# EAGLE design RAWX_Logger_Switches (EAGLE 9.4.1)
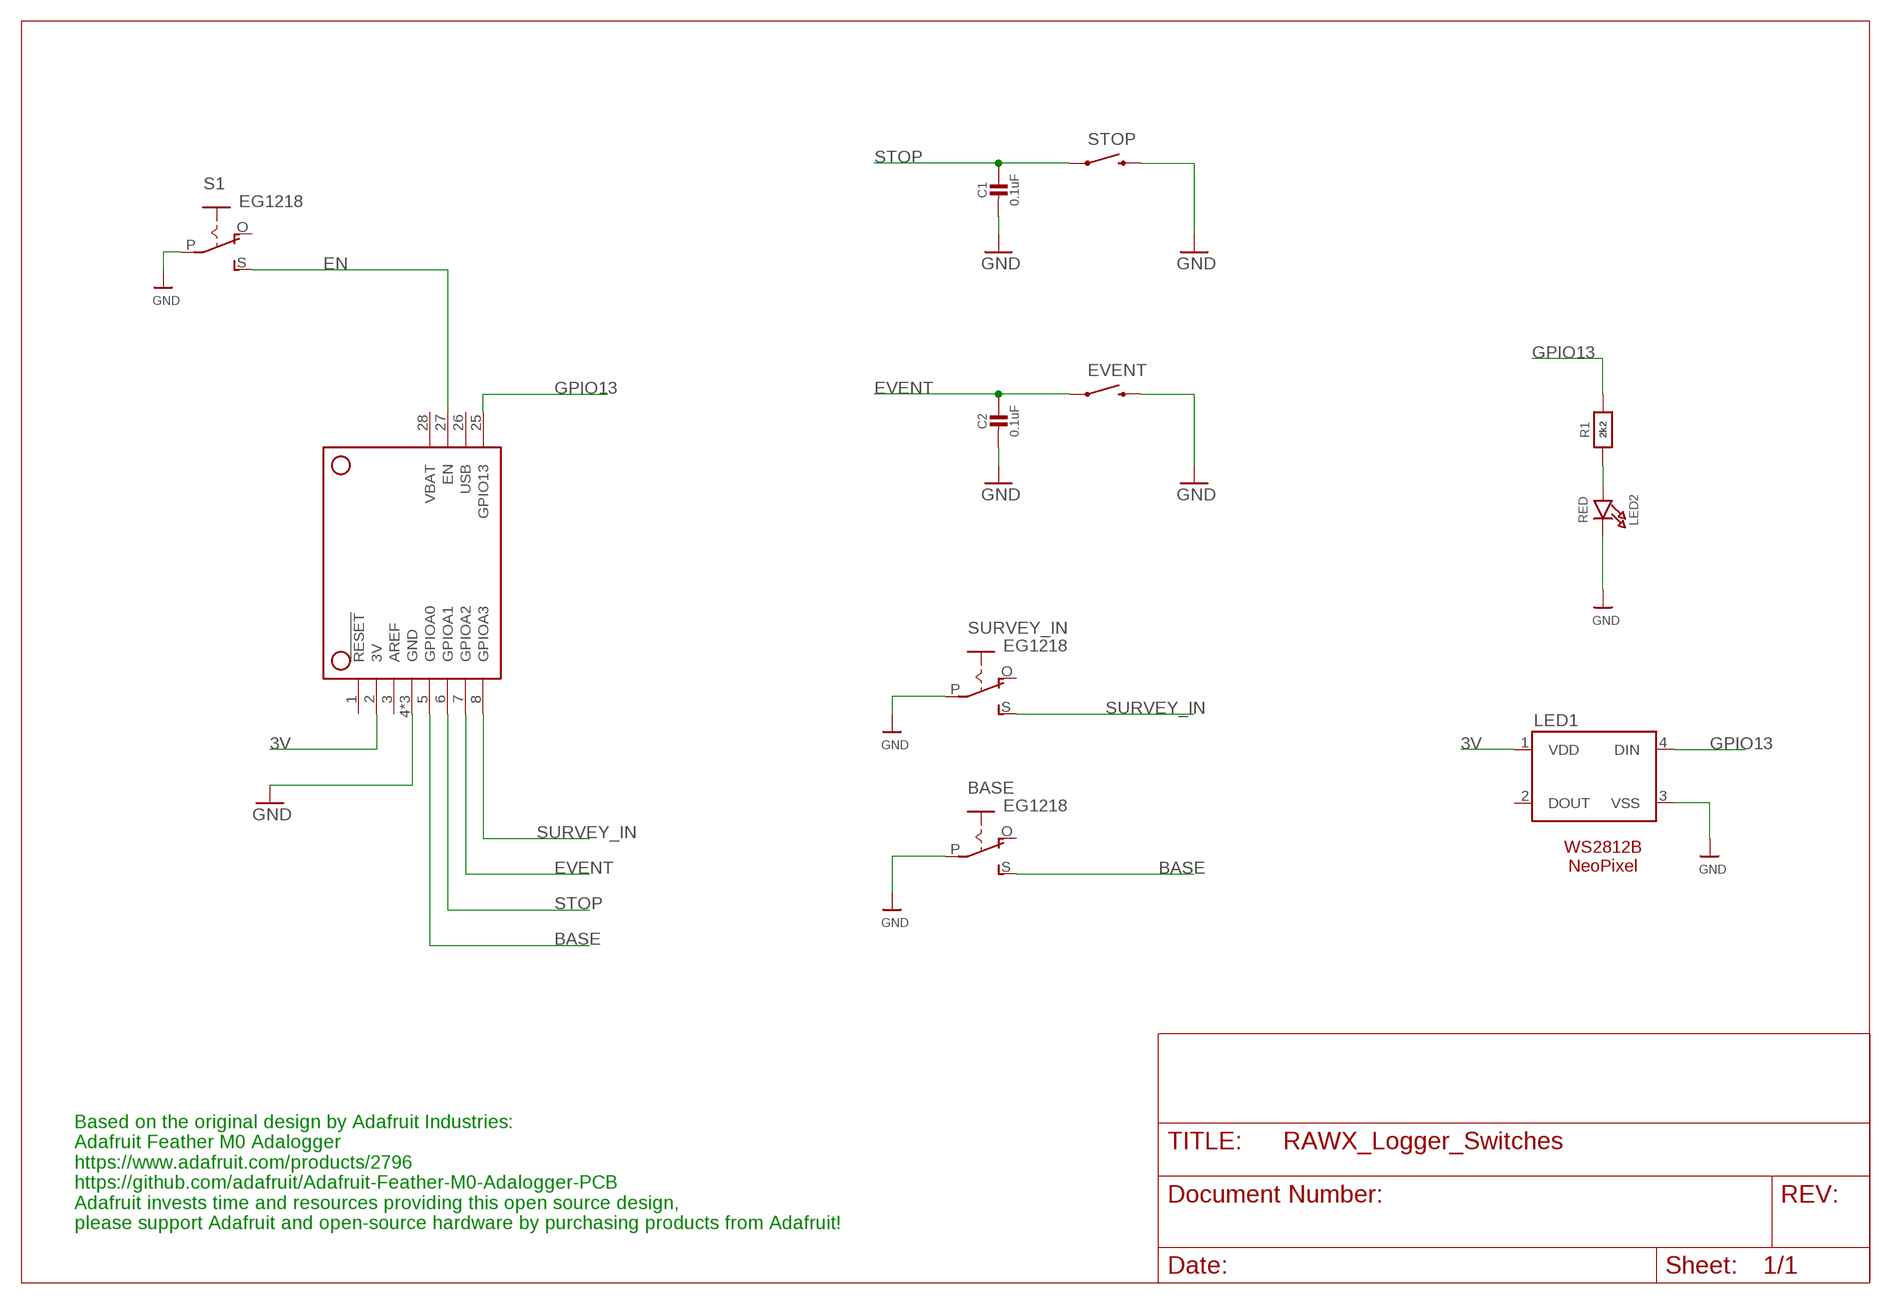
[diagram p0: schematic, sheet 1]

## Parts
BASE  EG1218  EG1218S  [EG1218]
C1  0.1uF  CAP_CERAMIC0603_NO  [0603-NO]
C2  0.1uF  CAP_CERAMIC0603_NO  [0603-NO]
EVENT  SWITCH-MOMENTARY-2PTH  [TACTILE-PTH]
LED1  WS2812B  [WS2812B]
LED2  RED  LED0805_NOOUTLINE  [CHIPLED_0805_NOOUTLINE]
MS1  MICROBUILDER_FEATHERWING_EN_SWITCH  [MICROBUILDER_FEATHERWING_EN_SWITCH]
R1  2k2  RESISTOR0805_NOOUTLINE  [0805-NO]
S1  EG1218  EG1218S  [EG1218]
STOP  SWITCH-MOMENTARY-2PTH  [TACTILE-PTH]
SURVEY_IN  EG1218  EG1218S  [EG1218]

## Nets
3V: LED1.1(VDD) MS1.2(3V)
BASE: BASE.S MS1.5(GPIOA0)
EN: MS1.27(EN) S1.S
EVENT: C2.1 EVENT.1 MS1.7(GPIOA2)
GND: BASE.P C1.2 C2.2 EVENT.3 LED1.3(VSS) LED2.C MS1.4(GND) MS1.P$1(GND) MS1.P$2(GND) S1.P STOP.3 SURVEY_IN.P
GPIO13: LED1.4(DIN) MS1.25(GPIO13) R1.2
N$3: LED2.A R1.1
STOP: C1.1 MS1.6(GPIOA1) STOP.1
SURVEY_IN: MS1.8(GPIOA3) SURVEY_IN.S
Unconnected: BASE.O LED1.2(DOUT) MS1.1(!RESET) MS1.3(AREF) MS1.26(USB) MS1.28(VBAT) S1.O SURVEY_IN.O

## Notes on the sheet
- WS2812B
  NeoPixel
- Based on the original design by Adafruit Industries:
  Adafruit Feather M0 Adalogger
  https://www.adafruit.com/products/2796
  https://github.com/adafruit/Adafruit-Feather-M0-Adalogger-PCB
  Adafruit invests time and resources providing this open source design,
  please support Adafruit and open-source hardware by purchasing products from Adafruit!

## Library data of the parts
BASE S1 SURVEY_IN = adafruit:EG1218: SLIDING SWITCH 0.1" spacing through hole, vertical SPDT slide switch http://www.ladyada.net/library/pcb/eaglelibrary.html
C1 C2 = microbuilder:CAP_CERAMIC: Ceramic Capacitors For new designs, use the packages preceded by an '_' character since they are more reliable: The following footprints should be used on most boards: _0402 - Standard footprint for regular board layouts _0603 - Standard footprint for regular board layouts _0805 - Standard footprint for regular board layouts _1206 - Standard footprint for regular board layouts For extremely tight-pitch boards where space is at a premium, the following 'micro-pitch' footprints can be used (smaller pads, no silkscreen outline, etc.): _0402MP - Micro-pitch footprint for very dense/compact boards _0603MP - Micro-pitch footprint for very dense/compact boards _0805MP - Micro-pitch footprint for very dense/compact boards _1206MP - Micro-pitch footprint for very dense/compact boards
EVENT STOP = SparkFun-Electromechanical:SWITCH-MOMENTARY-2: Various NO switches- pushbuttons, reed, etc; PROD_ID: SWCH-08441
LED1 = SparkFun-LED:WS2812B: WS2812B - Intelligent control LED integrated light source Technical Specifications: Power Supply Voltage (VDD): 3.5 to 5.3 V Input Voltage (VI): -0.5 to VDD+0.5 V Operating Junction Temperature (Topt): -25°C to +80°C Storage Temperature Range (Tstg): -55°C to +150°C; PROD_ID: DIO-12503
LED2 = microbuilder:LED: LED 0603 - 0603 Surface Mount Package 2mA: Green LED - Low Power (3.9mcd, 2ma, 1.7Vf) - Digikey: 475-2709-2-ND Orange LED - Low Power (9.8mcd, 2ma, 1.8Vf) - Digikey: 475-1194-2-ND Red LED - Low Power (5mcd, 2ma, 1.8Vf) - Digikey: 475-1195-2-ND Yellow LED - Low Power (7mcd, 2ma, 1.8Vf) - Digikey: 475-1196-2-ND 5mA: Blue LED - Low Power (17mcd, 5ma, 2.9Vf) - Digikey: LNJ937W8CRACT-ND 0805 - 0805 Surface Mount Package 2mA: Red LED (8.8mcd, 2mA, 1.8Vf, Clear) - Low Power [Digikey: 475-2510-1-ND] Green LED (5mcd, 2mA, 1.8Vf, Clear) - Low Power [Digikey: 475-2730-1-ND] Yellow LED (11.3mcd, 2mA, 1.8Vf, Clear) - Low Power [Digikey: 475-2555-1-ND] 20mA: Red LED (104mcd, 20mA, Diffused) - LS R976 [Digikey: 475-1278-6-ND] Red LED (12mcd, 20mA, 2.0Vf, Clear) - APT2012EC [Digikey: 754-1128-1-ND] Green LED (15mcd, 20mA, 2.2Vf, Clear) - APT2012GC [Digikey: 754-1131-1-ND] Orange LED (160mcd, 20mA, 2.1Vf, Clear) - APT2012SECK [Digikey: 754-1130-1-ND] 1206 - 1206 Surface Mount Package Green LED (26mcd, 20mA, Diffused) - LG N971 [Digikey: 475-1407-6-ND] Red LED (15mcd, 20mA, Diffused) - LH N974 [Digikey: 475-1416-6-ND] Cree - Cree High-Power Surface Mount LEDs XPEBWT-L1-0000-00D50 - White 111lm 350mA 2.9Vf 6200K 110° XTEAWT-00-0000-00000LEE3 - White 114lm 350mA 2.85Vf 5000K 115° Everlight - Everlight 45-21 Series Surface Mount LEDs 45-21/QK2C-B2832AC2CB2/2T - Warm White 2000mcd 20mA 3.25Vf 3050K 120° 45-21/LK2C-B38452C4CB2/2T - Nuetral White 2000mcd 20mA 3.25Vf 4150K 120° 45-21/LK2C-B50634C6CB2/2T - Cold White 2200mcd 20mA 3.25Vf 5650K 120° PLCC2 Reverse Mount LS T77K-J1L2-1-0-2-R18-Z - Red 11.25mcd 2mA 1.8Vf 630nm 120° LO T77K-L1M2-24-Z - Orange 19.6mcd 2mA 1.8Vf 606nm 120° LY T77K-K2M1-26-Z - Yellow 15.7mcd 2mA 1.8Vf 587nm 120°
MS1 = NEO-M8T GNSS FeatherWing:MICROBUILDER_FEATHERWING_EN_SWITCH
R1 = microbuilder:RESISTOR: Resistors For new designs, use the packages preceded by an '_' character since they are more reliable: The following footprints should be used on most boards: _0402 - Standard footprint for regular board layouts _0603 - Standard footprint for regular board layouts _0805 - Standard footprint for regular board layouts _1206 - Standard footprint for regular board layouts For extremely tight-pitch boards where space is at a premium, the following 'micro-pitch' footprints can be used (smaller pads, no silkscreen outline, etc.): _0402MP - Micro-pitch footprint for very dense/compact boards _0603MP - Micro-pitch footprint for very dense/compact boards _0805MP - Micro-pitch footprint for very dense/compact boards _1206MP - Micro-pitch footprint for very dense/compact boards

## Board
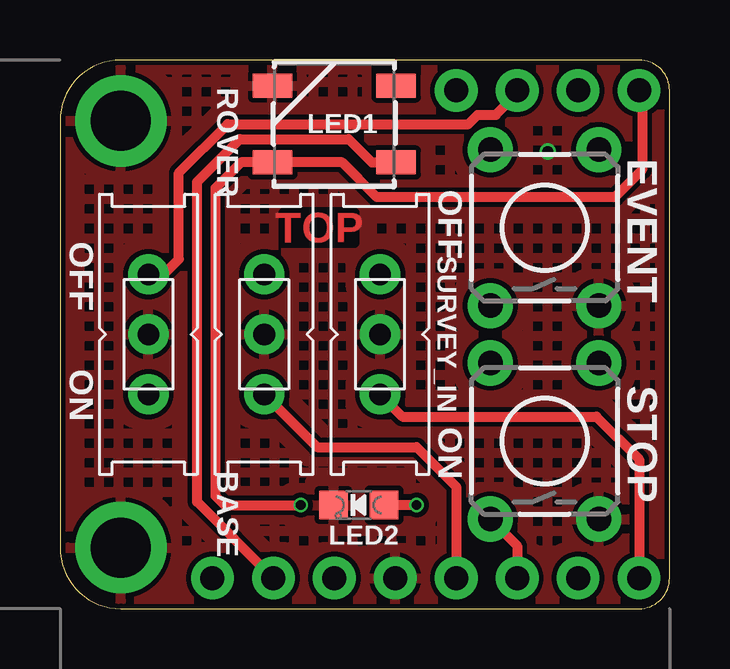
[diagram p1: board, top side]
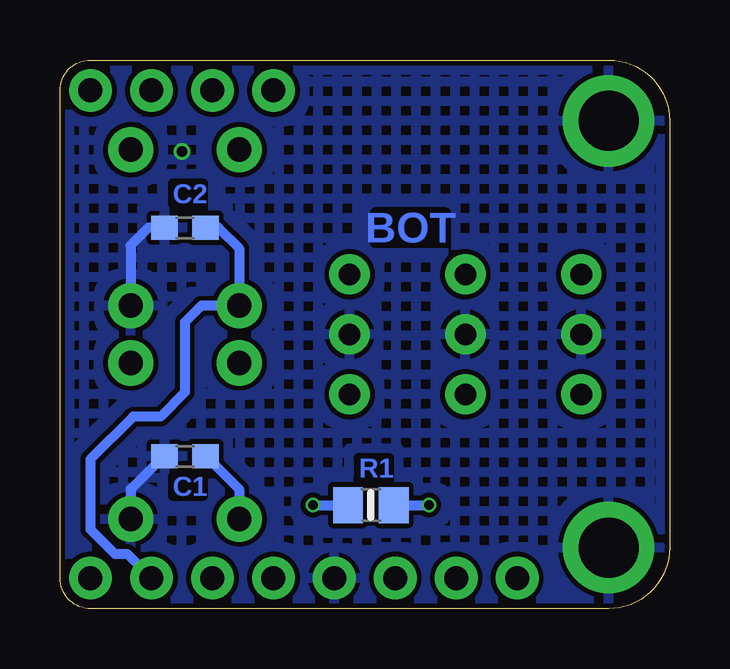
[diagram p2: board, bottom side, seen from below]

Size 25.4 x 22.86 mm. Coordinates in mm from the lower left corner, seen from the top.
Copper layers (1*16): Top 0.018mm / dielectric 1.55mm / Bottom 0.018mm
Design rules "Multi-CB_2L_100um-Tracks_OL35um": minimum track width 0.1mm, minimum drill 0.2mm, track to track 0.1mm, track to pad 0.1mm, pad to pad 0.1mm, via to via 0.1mm, smd to smd 0mil, copper to edge 0.2mm, drill to drill 0.2mm, minimum pad ring 0.125mm, minimum via ring 0.1mm, stop-mask expansion 2mil, vias tented up to drill 0.45mm, thermal gap 0.2mm

### Footprints (pad centres in the part's own frame; a part is rotated, then mirrored left to right if it is on the bottom)
EG1218 = drill 0.9 pad 1.676: O -2.499,0; P 0,0; S 2.499,0
0603-NO = smd 1.1 x 1: 1 -0.85,0; 2 0.85,0
TACTILE-PTH = drill 1.016 pad 1.88: 1 -3.251,2.261; 2 3.251,2.261; 3 -3.251,-2.261; 4 3.251,-2.261
WS2812B = smd 1.651 x 1: 1 -2.577,1.6; 2 -2.577,-1.6; 3 2.577,-1.6; 4 2.577,1.6
CHIPLED_0805_NOOUTLINE = smd 1.2 x 1.2: A 0,-1.05; C 0,1.05
MICROBUILDER_FEATHERWING_EN_SWITCH = drill 1 pad 1.778: 1 6.35,1.27; 2 8.89,1.27; 3 11.43,1.27; 4 13.97,1.27; 5 16.51,1.27; 6 19.05,1.27; 7 21.59,1.27; 8 24.13,1.27; 25 24.13,21.59; 26 21.59,21.59; 27 19.05,21.59; 28 16.51,21.59 | drill 2.5 pad 3.81: P$1 2.54,20.32; P$2 2.54,2.54
0805-NO = smd 1.24 x 1.5: 1 -0.95,0; 2 0.95,0

### Placement (x,y rotation side)
BASE  8.51,11.43 270 top
C1  20.19,6.35 180 bottom
C2  20.19,15.88 180 bottom
EVENT  20.19,15.88 90 top
LED1  11.43,20.19 180 top
LED2  12.45,4.32 90 top
MS1  0,0 0 top
R1  12.45,4.32 0 bottom
S1  3.68,11.43 90 top
STOP  20.19,6.99 90 top
SURVEY_IN  13.34,11.43 270 top

### Tracks (layer width: path | path; a pad name or v marks a point on that pad's centre or on a via)
3V
  Top 0.406: LED1.1 12.99,18.59 12.03,19.56 7.49,19.56 5.71,17.78 5.71,4.45 MS1.2
BASE
  Top 0.406: BASE.S 10.71,6.73 14.86,6.73 16.51,5.08 MS1.5
EN
  Top 0.406: S1.S 4.32,13.93 4.95,14.56 4.95,18.16 6.99,20.19 17.02,20.19 17.4,20.57 18.16,20.57 19.05,21.46 MS1.27
EVENT
  Bottom 0.406: C2.1 18.8,15.88 17.93,15.01 EVENT.1 19.51,12.62 20.19,11.94 20.19,9.02 21.21,8 22.35,8 24.13,6.22 24.13,3.3 23.11,2.29 22.61,2.29 MS1.7
GND  (via drill 0.45)
  Bottom 0.406: C2.2 21.72,15.88 22.45,15.14 EVENT.3 | STOP.3 22.45,4.98 21.08,6.35 C1.2
  other vias: 20.32,19.05
  pour Bottom (isolate 0.203, hatched): 0,2.54 arc90 2.54,0 24.13,0 arc90 25.4,1.27 25.4,21.59 arc90 24.13,22.86 2.54,22.86 arc90 0,20.32
  pour Top (isolate 0.203, hatched): 0,2.54 arc90 2.54,0 24.13,0 arc90 25.4,1.27 25.4,21.59 arc90 24.13,22.86 2.54,22.86 arc90 0,20.32
GPIO13  (via drill 0.4)
  Top 0.406: MS1.25 24.26,21.46 24.26,18.29 23.11,17.14 13.21,17.14 11.76,18.59 LED1.4 7.54,18.59 6.48,17.53 6.48,4.7 6.86,4.32 v10.03,4.32
  Bottom 0.406: R1.2 v10.03,4.32
N$3  (via drill 0.4)
  Top 0.406: v14.86,4.32 LED2.A
  Bottom 0.406: v14.86,4.32 R1.1
STOP
  Top 0.406: STOP.1 19.05,2.62 MS1.6
  Bottom 0.406: STOP.1 17.93,4.98 19.3,6.35 C1.1
SURVEY_IN
  Top 0.406: SURVEY_IN.S 14.27,8 22.35,8 24.13,6.22 MS1.8

### Text on the board
Top: TOP
Bottom: C2 | BOT | R1 | C1
tPlace: ROVER | OFF | EVENT | OFF | SURVEY_IN | ON | STOP | ON | BASE